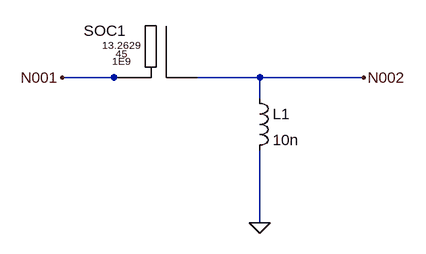
[diagram p0: schematic PasaAltasStubCapacitor.asc]
PasaAltasStubCapacitor.asc, the LTspice schematic file:
Version 4
SHEET 1 880 680
WIRE -16 96 -96 96
WIRE 0 96 -16 96
WIRE 208 96 112 96
WIRE 368 96 208 96
WIRE 208 128 208 96
WIRE 208 320 208 208
FLAG 208 320 0
FLAG 368 96 N002
FLAG -96 96 N001
SYMBOL SOC 80 64 R0
SYMATTR SpiceModel 13.2629
SYMATTR Value 45
SYMATTR Value2 1E9
SYMATTR InstName SOC1
SYMBOL ind 192 112 R0
SYMATTR InstName L1
SYMATTR Value 10n

The netlist it stands for:
* PasaAltasStubCapacitor.asc
SOC1 N001 N002 13.2629 45 1E9
L1 N002 0 10n
.backanno
.end